# EAGLE design BP_MCU (EAGLE 9.7.0)
Assembly variants: Filtr
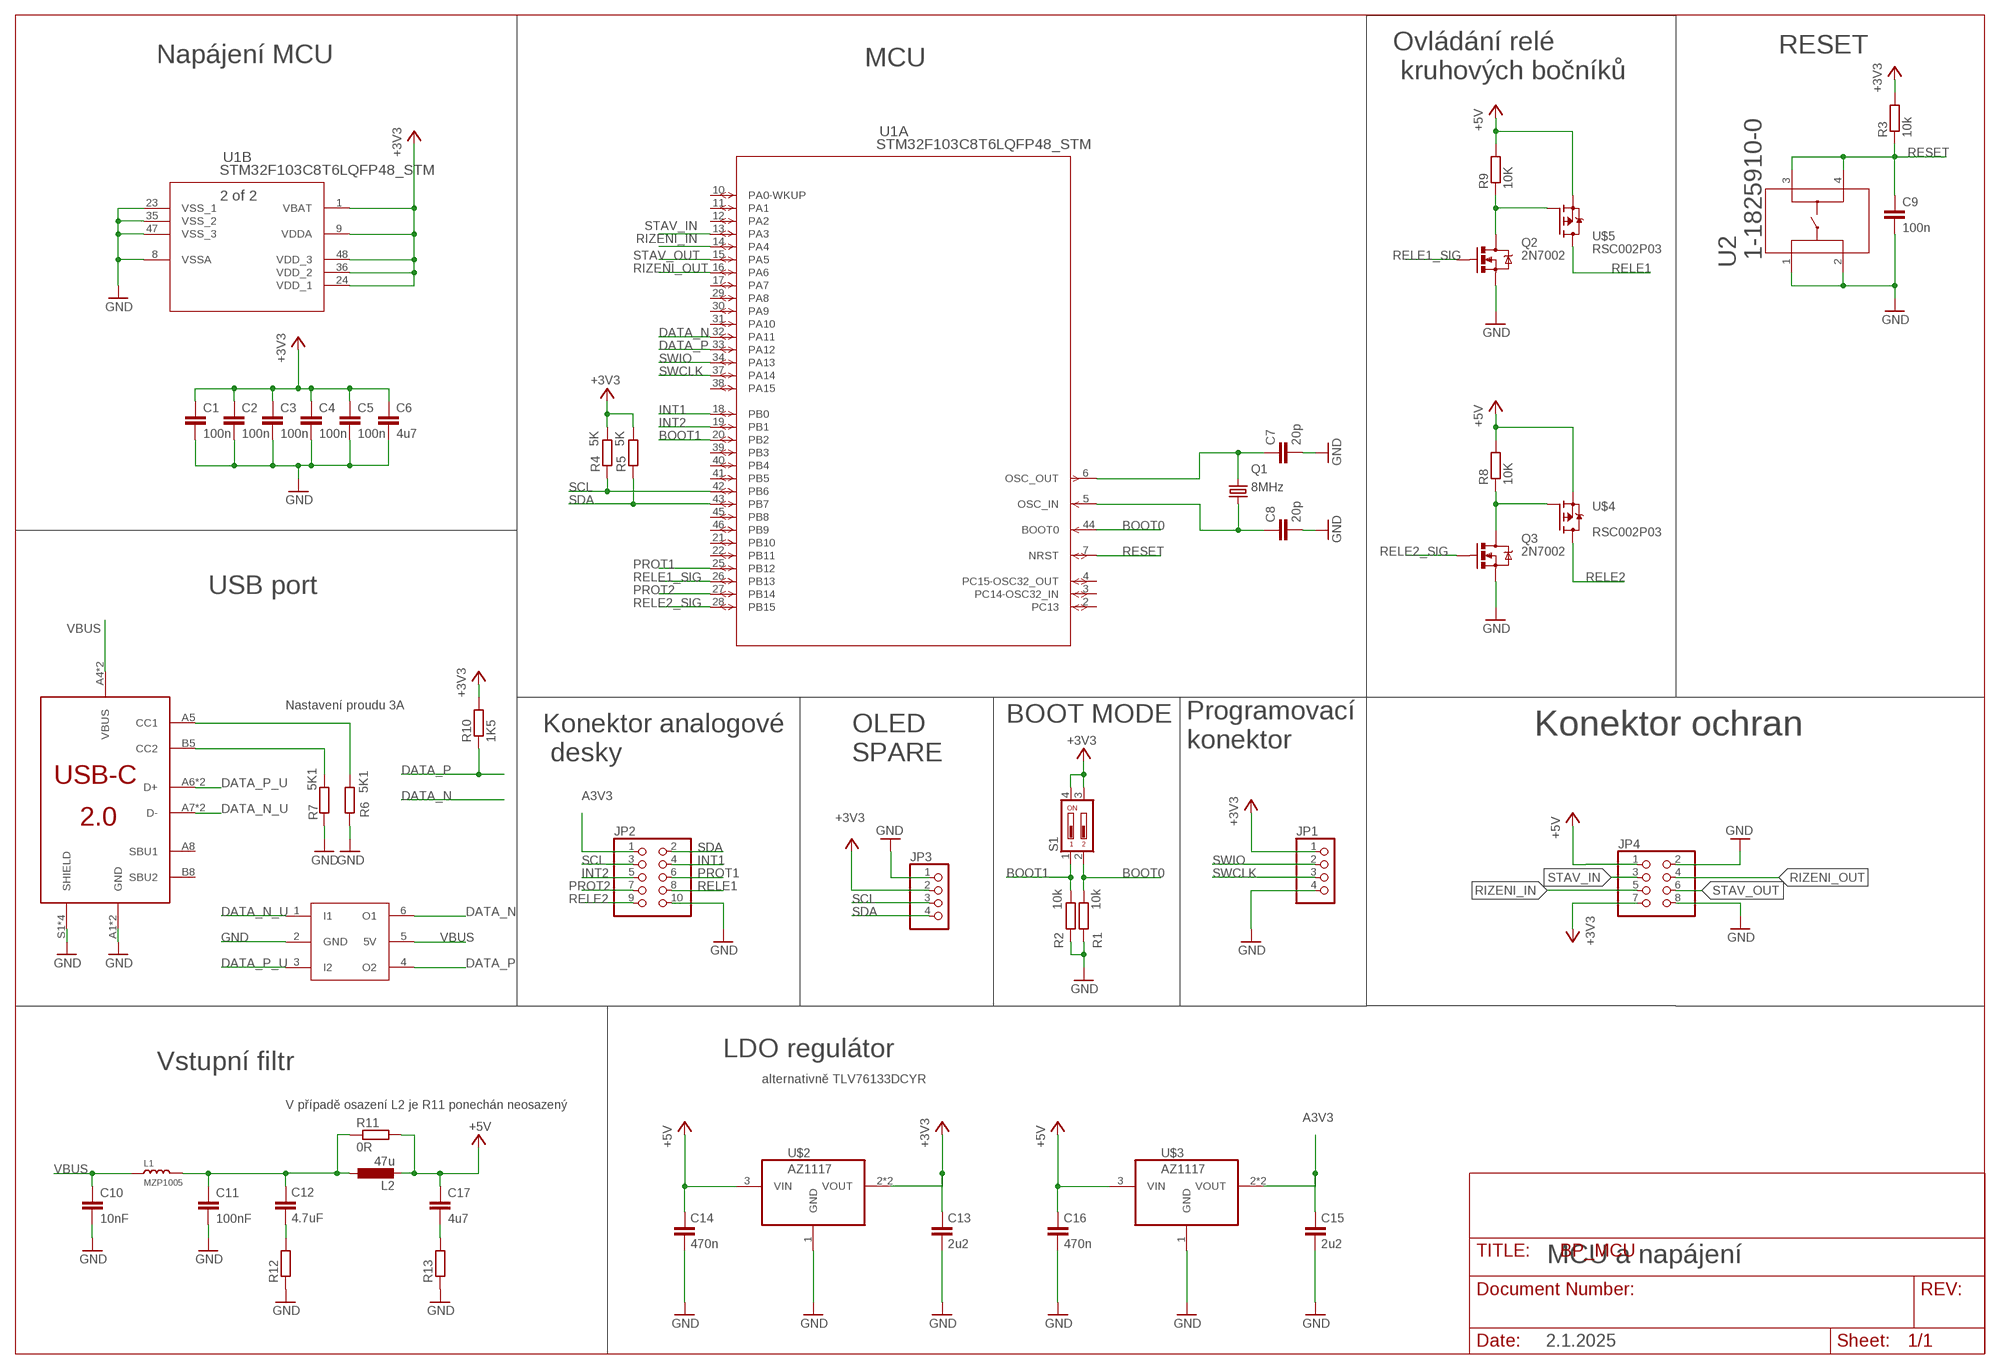
[diagram p0: schematic, sheet 1]

## Parts
C1  100n  C-EUC0805  [C0805]
C2  100n  C-EUC0805  [C0805]
C3  100n  C-EUC0805  [C0805]
C4  100n  C-EUC0805  [C0805]
C5  100n  C-EUC0805  [C0805]
C6  4u7  C-EUC0805  [C0805]
C7  20p  C-EUC0805  [C0805]
C8  20p  C-EUC0805  [C0805]
C9  100n  C-EUC0805  [C0805]
C10  10nF  C-EUC0805  [C0805]
C11  100nF  C-EUC0805  [C0805]
C12  4.7uF  C-EUC0805  [C0805]
C13  2u2  C-EUC0805  [C0805]
C14  470n  C-EUC0805  [C0805]
C15  2u2  C-EUC0805  [C0805]
C16  470n  C-EUC0805  [C0805]
C17  4u7  C-EUC0805  [C0805]
JP1  PINHD-1X4  [1X04]
JP2  PINHD-2X5  [2X05]
JP3  PINHD-1X4  [1X04]
JP4  PINHD-2X4  [2X04]
L1  MZP1005  INDUCTOR_INDUCTOR/FERRITE-BEAD0402  [INDUCTOR_L0402]
L2  47u  AMRM00101040470MA1  [AMRM001]
Q1  8MHz  CRYSTALHC49UP  [HC49UP]
Q2  2N7002  MOSFET-NCHANNEL2N7002PW  [SOT323]
Q3  2N7002  MOSFET-NCHANNEL2N7002PW  [SOT323]
R1  10k  R-EU_R0805  [R0805]
R2  10k  R-EU_R0805  [R0805]
R3  10k  R-EU_R0805  [R0805]
R4  5K  R-EU_R0805  [R0805]  (not fitted in variant Filtr)
R5  5K  R-EU_R0805  [R0805]  (not fitted in variant Filtr)
R6  5K1  R-EU_R0805  [R0805]
R7  5K1  R-EU_R0805  [R0805]
R8  10K  R-EU_R0805  [R0805]
R9  10K  R-EU_R0805  [R0805]
R10  1K5  R-EU_R0805  [R0805]
R11  0R  R-EU_R0805  [R0805]  (not fitted in variant Filtr)
R12  R-EU_R0805  [R0805]
R13  R-EU_R0805  [R0805]
S1  SD4-02  [SD4-02]
U1  STM32F103C8T6LQFP48_STM  [LQFP48_STM]
U2  1-1825910-0  [SWITCH_1-1825910-0]
U$1  217179-0001-USB-C  [TYPEC16]
U$2  AZ1117  [SOT230P700X180-4N]
U$3  AZ1117  [SOT230P700X180-4N]
U$4  RSC002P03  [SOT95]
U$5  RSC002P03  [SOT95]
U$6  USBLC6-2  [SOT23-6L]

## Nets
+3V3: C1.1 C2.1 C3.1 C4.1 C5.1 C6.1 C13.1 JP1.1 JP3.2 JP4.7 R3.2 R4.2 R5.2 R10.2 S1.3 S1.4 U1.1(B:VBAT) U1.9(B:VDDA) U1.24(B:VDD_1) U1.36(B:VDD_2) U1.48(B:VDD_3) U$2.2(VOUT) U$2.4(VOUT)
+5V: C14.1 C16.1 C17.1 JP4.1 L2.P$2 R8.2 R9.2 R11.2 U$2.3(VIN) U$3.3(VIN) U$4.1(S) U$5.1(S)
A3V3: C15.1 JP2.1 U$3.2(VOUT) U$3.4(VOUT)
BOOT0: R1.2 S1.2 U1.44(A:BOOT0)
BOOT1: R2.2 S1.1 U1.20(A:PB2)
DATA_N: U1.32(A:PA11) U$6.6(O1)
DATA_N_U: U$1.A7(D-) U$1.B7(D-) U$6.1(I1)
DATA_P: R10.1 U1.33(A:PA12) U$6.4(O2)
DATA_P_U: U$1.A6(D+) U$1.B6(D+) U$6.3(I2)
GND: C1.2 C2.2 C3.2 C4.2 C5.2 C6.2 C7.2 C8.2 C9.2 C10.2 C11.2 C13.2 C14.2 C15.2 C16.2 JP1.4 JP2.10 JP3.1 JP4.2 JP4.8 Q2.2(S) Q3.2(S) R1.1 R2.1 R6.2 R7.2 R12.1 R13.1 U1.8(B:VSSA) U1.23(B:VSS_1) U1.35(B:VSS_2) U1.47(B:VSS_3) U2.1 U2.2 U$1.A1(GND) U$1.A12(GND) U$1.S1(SHIELD) U$1.S2(SHIELD) U$1.S3(SHIELD) U$1.S4(SHIELD) U$2.1(GND) U$3.1(GND) U$6.2(GND)
INT1: JP2.4 U1.18(A:PB0)
INT2: JP2.5 U1.19(A:PB1)
N$1: Q2.3(D) R9.1 U$5.2(G)
N$2: Q3.3(D) R8.1 U$4.2(G)
N$3: R7.1 U$1.B5(CC2)
N$4: R6.1 U$1.A5(CC1)
N$5: C12.2 R12.2
N$6: C11.1 C12.1 L1.2 L2.P$1 R11.1
N$7: C17.2 R13.2
OSC_N: C8.1 Q1.1 U1.5(A:OSC_IN)
OSC_P: C7.1 Q1.2 U1.6(A:OSC_OUT)
PROT1: JP2.6 U1.25(A:PB12)
PROT2: JP2.7 U1.27(A:PB14)
RELE1: JP2.8 U$5.3(D)
RELE1_SIG: Q2.1(G) U1.26(A:PB13)
RELE2: JP2.9 U$4.3(D)
RELE2_SIG: Q3.1(G) U1.28(A:PB15)
RESET: C9.1 R3.1 U1.7(A:NRST) U2.3 U2.4
RIZENI_IN: JP4.5 U1.14(A:PA4)
RIZENI_OUT: JP4.4 U1.16(A:PA6)
SCL: JP2.3 JP3.3 R4.1 U1.42(A:PB6)
SDA: JP2.2 JP3.4 R5.1 U1.43(A:PB7)
STAV_IN: JP4.3 U1.13(A:PA3)
STAV_OUT: JP4.6 U1.15(A:PA5)
SWCLK: JP1.3 U1.37(A:PA14)
SWIO: JP1.2 U1.34(A:PA13)
VBUS: C10.1 L1.1 U$1.A4(VBUS) U$1.A9(VBUS) U$6.5(5V)
Unconnected: U1.2(A:PC13) U1.3(A:PC14-OSC32_IN) U1.4(A:PC15-OSC32_OUT) U1.10(A:PA0-WKUP) U1.11(A:PA1) U1.12(A:PA2) U1.17(A:PA7) U1.21(A:PB10) U1.22(A:PB11) U1.29(A:PA8) U1.30(A:PA9) U1.31(A:PA10) U1.38(A:PA15) U1.39(A:PB3) U1.40(A:PB4) U1.41(A:PB5) U1.45(A:PB8) U1.46(A:PB9) U$1.A8(SBU1) U$1.B8(SBU2)

## Notes on the sheet
- RESET
- MCU
- Ovládání relé
   kruhových bočníků
- Napájení MCU
- USB port
- Nastavení proudu 3A | BOOT MODE
- Konektor ochran
- Programovací 
  konektor
- Konektor analogové
   desky
- OLED 
  SPARE
- LDO regulátor
- Vstupní filtr
- alternativně TLV76133DCYR
- V případě osazení L2 je R11 ponechán neosazený
- MCU a napájení
- 2.1.2025

## Library data of the parts
C1-C10 C13-C17 = rcl:C-EU: CAPACITOR, European symbol; SPICEPREFIX: C
C11 C12 = resistor:C-EU: CAPACITOR, European symbol
JP1 JP3 = pinhead:PINHD-1X4: PIN HEADER
JP2 = pinhead:PINHD-2X5: PIN HEADER
JP4 = pinhead:PINHD-2X4: PIN HEADER
L1 = BeagleBone_Blue_R3:INDUCTOR_INDUCTOR/FERRITE-BEAD
L2 = Induktory:AMRM00101040470MA1
Q1 = crystal:CRYSTAL: CRYSTAL; OC_FARNELL: unknown; OC_NEWARK: unknown
Q2 Q3 = BeagleBone_Blue_R3:MOSFET-NCHANNEL: Common NMOSFET Parts MFG P/N Store ID Prod ID FDD8780 TRANS-09984 SI7820DN TRANS-11055 FDS6630A IC-08089 2N7002PW TRANS-11151 FQP30N06L COM-10213 TRANS-10060 BSS123LT1G TRANS-08345 BSS138 TRANS-00830 BS170 2N7000; PROD_ID: TRANS-11151
R1-R13 = rcl:R-EU_: RESISTOR, European symbol; SPICEPREFIX: R
S1 = switch-dil:SD4-02: DIL/CODE SWITCH; OC_FARNELL: unknown; OC_NEWARK: unknown
U1 = 2024-10-04_13-16-44_Library:STM32F103C8T6; COPYRIGHT: Copyright (C) 2024 Ultra Librarian. All rights reserved.; MANUFACTURER_PART_NUMBER: STM32F103C8T6; MFR_NAME: STMicroelectronics
U2 = Switches:1-1825910-0; BUILT_BY: EMA_UL_Team; CATEGORY: Tactile Switches; COPYRIGHT: Copyright (C) 2016 Accelerated Designs. All rights reserved; DESCRIPTION: FSM6JH=6MM TACT SWITCH, HIGH TEMP; MANUFACTURER_PART_NUMBER: 1-1825910-0; PART_STATUS: active; SERIES: Unknown; VENDOR: TE Connectivity
U$1 = USB_conn:217179-0001-USB-C
U$2 U$3 = Regulatory:AZ1117
U$4 U$5 = Mosfety:RSC002P03
U$6 = ESD:USBLC6-2

## Board
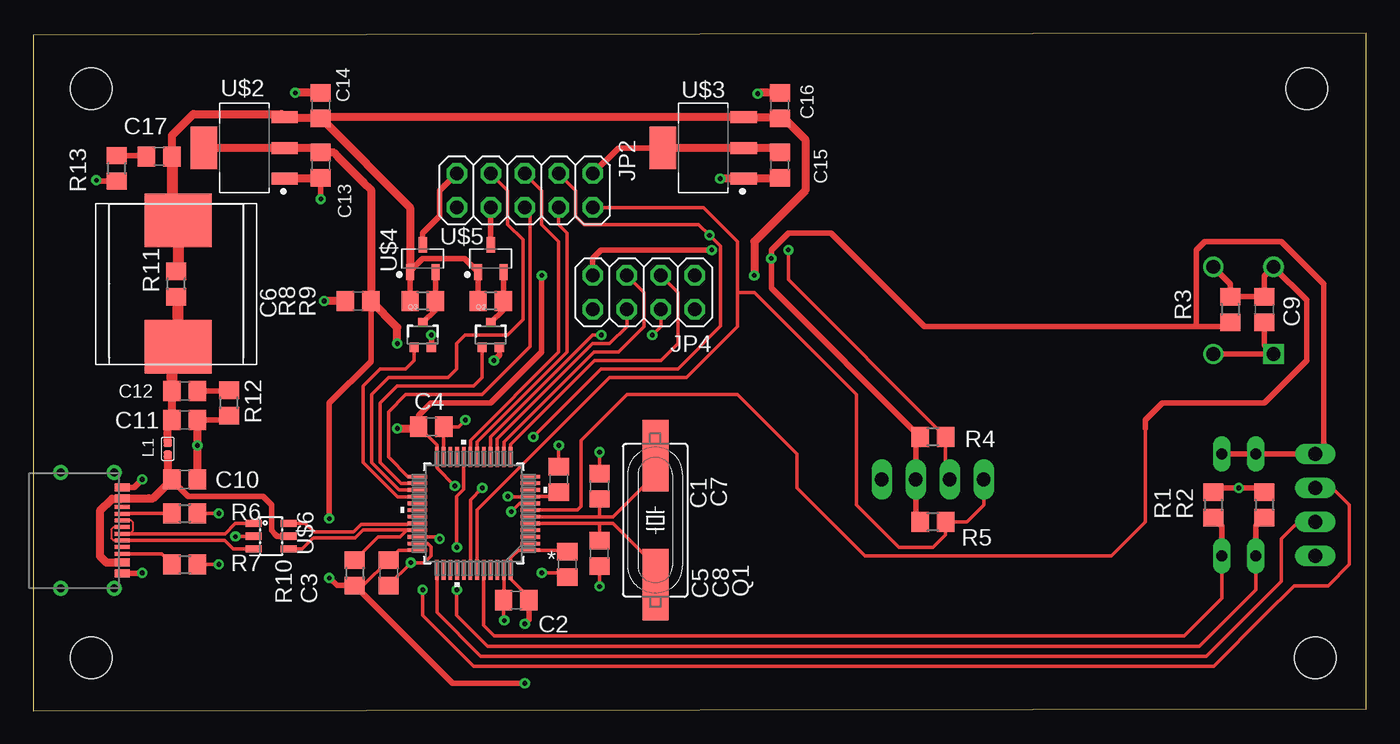
[diagram p1: board, top side]
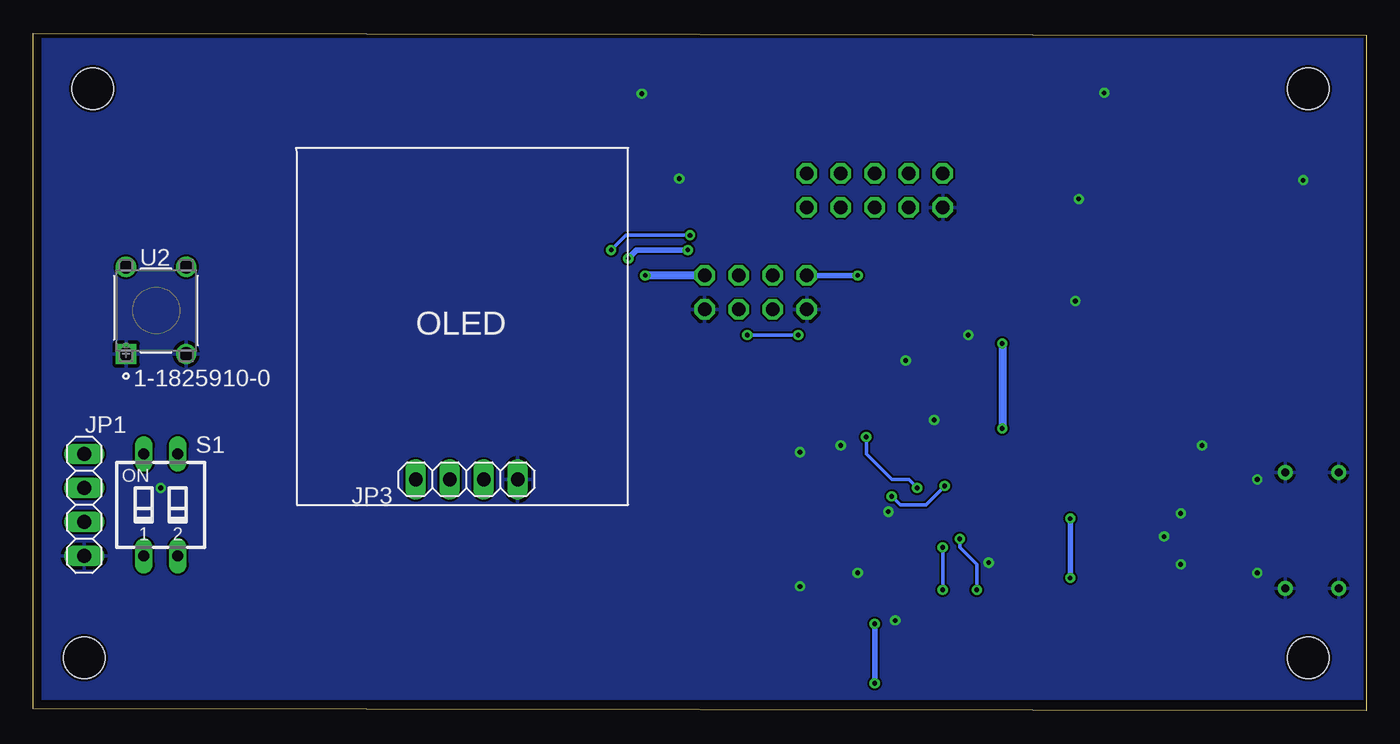
[diagram p2: board, bottom side, seen from below]

Size 99.55 x 50.6 mm. Coordinates in mm from the lower left corner, seen from the top.
Outline: 0,0 99.55,0.13 99.55,50.6 0,50.47 0,0
Copper layers (1*16): Top 0.035mm / dielectric 1.5mm / Bottom 0.035mm
Design rules "Fusion Electronics Design Rules": minimum track width 6mil, minimum drill 0.35mm, track to track 6mil, track to pad 6mil, pad to pad 6mil, via to via 6mil, smd to smd 6mil, copper to edge 0.2mm, drill to drill 0.45mm, minimum pad ring 10mil, minimum via ring 8mil, stop-mask expansion 4mil, vias tented up to drill 0mil, thermal gap 10mil
Holes 3.1 mm at 4.32,46.48 4.32,3.94 95.12,46.48 95.76,3.94

### Footprints (pad centres in the part's own frame; a part is rotated, then mirrored left to right if it is on the bottom)
C0805 = smd 1.3 x 1.5: 1 -0.95,0; 2 0.95,0
1X04 = drill 1.016 long: 1 -3.81,0; 2 -1.27,0; 3 1.27,0; 4 3.81,0
2X05 = drill 1.016 octagon: 1 -5.08,-1.27; 2 -5.08,1.27; 3 -2.54,-1.27; 4 -2.54,1.27; 5 0,-1.27; 6 0,1.27; 7 2.54,-1.27; 8 2.54,1.27; 9 5.08,-1.27; 10 5.08,1.27
2X04 = drill 1.016 octagon: 1 -3.81,-1.27; 2 -3.81,1.27; 3 -1.27,-1.27; 4 -1.27,1.27; 5 1.27,-1.27; 6 1.27,1.27; 7 3.81,-1.27; 8 3.81,1.27
INDUCTOR_L0402 = smd 0.635 x 0.635: 1 -0.445,0; 2 0.445,0
AMRM001 = smd 5 x 4: P$1 -0.127,4.695; P$2 -0.127,-4.746
HC49UP = smd 5.334 x 1.93: 1 -4.826,0; 2 4.826,0
SOT323 = smd 0.7 x 0.7: 1 -0.65,-0.925; 2 0.65,-0.925; 3 0,0.925
R0805 = smd 1.3 x 1.5: 1 -0.95,0; 2 0.95,0
SD4-02 = drill 0.813 long: 1 -1.27,-3.81; 2 1.27,-3.81; 3 1.27,3.81; 4 -1.27,3.81
LQFP48_STM = smd 1.473 x 0.279: 1 -4.216,2.75; 2 -4.216,2.25; 3 -4.216,1.75; 4 -4.216,1.25; 5 -4.216,0.75; 6 -4.216,0.25; 7 -4.216,-0.25; 8 -4.216,-0.75; 9 -4.216,-1.25; 10 -4.216,-1.75; 11 -4.216,-2.25; 12 -4.216,-2.75; 25 4.216,-2.75; 26 4.216,-2.25; 27 4.216,-1.75; 28 4.216,-1.25; 29 4.216,-0.75; 30 4.216,-0.25; 31 4.216,0.25; 32 4.216,0.75; 33 4.216,1.25; 34 4.216,1.75; 35 4.216,2.25; 36 4.216,2.75 | smd 0.279 x 1.473: 13 -2.75,-4.216; 14 -2.25,-4.216; 15 -1.75,-4.216; 16 -1.25,-4.216; 17 -0.75,-4.216; 18 -0.25,-4.216; 19 0.25,-4.216; 20 0.75,-4.216; 21 1.25,-4.216; 22 1.75,-4.216; 23 2.25,-4.216; 24 2.75,-4.216; 37 2.75,4.216; 38 2.25,4.216; 39 1.75,4.216; 40 1.25,4.216; 41 0.75,4.216; 42 0.25,4.216; 43 -0.25,4.216; 44 -0.75,4.216; 45 -1.25,4.216; 46 -1.75,4.216; 47 -2.25,4.216; 48 -2.75,4.216
SWITCH_1-1825910-0 = drill 1.016 pad 1.524 square: 1 -6.502,4.496 | drill 1.016 pad 1.524: 2 -6.502,0; 3 0,0; 4 0,4.496
TYPEC16 = smd 0.6 x 1.15: A1 -3.2,1.25; A4 -2.4,1.25; A9 2.4,1.25; A12 3.2,1.25 | smd 0.3 x 1.15: A5 -1.25,1.25; A6 -0.25,1.25; A7 0.25,1.25; A8 1.25,1.25; B5 1.75,1.25; B6 0.75,1.25; B7 -0.75,1.25; B8 -1.75,1.25 | drill 0.6 pad 1 slot 1.4 rotated 90: S1 -4.32,0.66; S2 4.32,0.66 | drill 0.6 pad 1 slot 1.8 rotated 90: S3 -4.32,-3.34; S4 4.32,-3.34
SOT230P700X180-4N = smd 1.966 x 0.891: 1 -3.023,2.3; 2 -3.023,0; 3 -3.023,-2.3 | smd 1.966 x 3.192: 4 3.023,0
SOT95 = smd 1.182 x 0.612: 1 -1.025,0.95; 2 -1.025,-0.95; 3 1.025,0
SOT23-6L = smd 0.55 x 1.2: 1 -0.95,-1.3; 2 0,-1.3; 3 0.95,-1.3; 4 0.95,1.3; 5 0,1.3; 6 -0.95,1.3

### Placement (x,y rotation side)
C1  39.24,17.27 90 top
C2  36.07,8.25 180 top
C3  26.54,10.29 270 top
C4  29.72,21.21 0 top
C5  39.88,10.92 270 top
C6  24.26,30.61 180 top
C7  42.29,16.76 90 top
C8  42.28,11.75 270 top
C9  91.95,29.97 270 top
C10  11.3,17.27 0 top
C11  11.3,21.72 0 top
C12  11.3,23.88 0 top
C13  21.46,40.77 270 top
C14  21.46,45.21 90 top
C15  55.75,40.77 270 top
C16  55.75,45.21 90 top
C17  9.4,41.4 180 top
JP1  95.76,15.37 270 bottom
JP2  36.7,38.86 180 top
JP3  67.18,17.27 180 bottom
JP4  45.59,31.24 180 top
L1  10.03,19.56 90 top
L2  10.67,31.88 180 top
Q1  46.46,14.22 90 top
Q2  34.16,28.07 0 top
Q3  29.08,28.07 0 top
R1  88.14,15.37 270 top
R2  91.95,15.37 270 top
R3  89.41,29.97 270 top
R4  67.18,20.45 180 top
R5  67.18,14.1 180 top
R6  11.3,14.73 0 top
R7  11.3,10.92 0 top
R8  29.08,30.61 180 top
R9  34.16,30.61 180 top
R10  24,10.29 270 top
R11  10.67,31.88 90 top
R12  14.6,22.99 90 top
R13  6.22,40.51 90 top
S1  90.04,15.37 0 bottom
U1  32.89,14.73 180 top
U2  88.14,33.15 90 bottom
U$1  5.38,13.46 270 top
U$2  15.75,42.04 180 top
U$3  50.04,42.04 180 top
U$4  29.08,33.78 90 top
U$5  34.16,33.78 90 top
U$6  17.75,13.03 270 top

### Tracks (layer width: path | path; a pad name or v marks a point on that pad's centre or on a via)
+3V3  (via drill 0.35)
  Top 0.254: C1.1 38.92,16 37.97,16 37.13,16 U1.9 35.45,15.98 v35.43,16 | C2.1 37.02,8.45 35.94,9.52 35.64,9.82 U1.48 35.64,11.39 35.69,11.43 36.24,11.98 U1.1 39.77,11.98 C5.1 | U1.36 27.29,11.98 C3.1 24.64,9.34 R10.2 | 28.87,21.21 C4.1 30.14,19.83 U1.24 30.14,18.12 v31.48,16.78
  Top 0.406: S1.3 S1.4 JP1.1 96.39,19.81 96.39,30.61 96.39,31.88 93.22,35.05 91.31,35.05 87.5,35.05 86.87,34.42 86.87,28.7 | C4.1 28.77,22.04 29.72,22.99 34.16,22.99 37.97,26.8 v37.97,32.51 | v22.1,14.35 22.1,22.99 25.21,26.1 C6.1 | v22.1,9.91 22.67,9.34 R10.2 31.31,2.03 v36.7,2.03 | R5.2 65.91,14.42 65.91,16.64 JP3.2 65.91,19.81 66.23,20.13 R4.2 55.12,31.56 v55.12,33.78 55.12,34.42 56.39,35.69 59.56,35.69 66.55,28.7 86.87,28.7 | v50.67,34.42 42.42,34.42 41.78,33.78 JP4.7 | 86.87,28.7 89.09,28.7 R3.2 | C2.1 37.02,6.79 v36.7,6.48
  Top 0.61: U$2.4 17.02,42.04 U$2.2 21.14,42.04 C13.1 22.42,41.72 22.73,41.4 24.64,39.5 25.21,38.93 C6.1 27.18,28.64 v27.18,27.43 | v27.18,21.08 28.75,21.08 28.87,21.21
  Bottom 0.254: v35.43,16 34.8,15.37 32.89,15.37 v31.48,16.78
  Bottom 0.406: v37.97,32.51 JP4.7 | v22.1,14.35 v22.1,9.91 | v55.12,33.78 54.48,34.42 v50.67,34.42 | v36.7,6.48 v36.7,2.03
  Bottom 0.61: v27.18,27.43 v27.18,21.08
+5V  (via drill 0.35)
  Top 0.406: R8.2 U$4.1 28.13,32.83 29.08,33.78 30.35,33.78 32.19,33.78 U$5.1 R9.2
  Top 0.61: 18.85,44.26 C14.1 21.62,44.1 | 18.85,44.26 U$2.3 | 18.85,44.26 18.53,44.58 11.94,44.58 10.35,42.99 C17.1 | 21.62,44.1 28.13,37.59 28.13,32.83 | 21.62,44.1 21.86,44.34 U$3.3 55.68,44.34 C16.1 56.07,44.26 57.66,42.67 57.66,38.86 53.85,35.05 v53.85,32.51
  Top 0.813: C17.1 10.35,36.76 9.78,36.2 10.37,36.2 L2.P$2 10.79,32.95 R11.2
  Bottom 0.61: JP4.1 v53.85,32.51
A3V3
  Top 0.406: JP2.1 43.69,42.04 U$3.4
  Top 0.61: C15.1 55.43,42.04 U$3.2 U$3.4
BOOT0
  Top 0.254: S1.2 88.77,8.38 87.5,7.11 85.98,5.59 34.42,5.59 33.64,6.36 U1.44
  Top 0.406: R1.2 88.77,13.78 S1.2
BOOT1  (via drill 0.35)
  Top 0.254: v31.62,9.02 31.62,7.11 33.93,4.8 87.1,4.8 91.31,9.02 S1.1 | v31.62,12.19 31.62,16 32.14,16.52 32.14,16.64 U1.20
  Top 0.406: R2.2 91.31,13.78 S1.1
  Bottom 0.254: v31.62,9.02 v31.62,12.19
DATA_N
  Top 0.254: U1.32 27.98,13.98 27.92,13.92 24.46,13.92 23.94,13.4 23.88,13.34 20.96,13.34 20.31,13.98 U$6.6
DATA_N_U
  Top 0.152: U$1.B7 7.28,14.21 7.44,14.06 7.44,13.47 7.18,13.21 U$1.A7
  Top 0.254: U$1.A7 14.31,13.21 15.08,13.98 U$6.1
DATA_P
  Top 0.152: 27.81,13.51 27.84,13.48 U1.33
  Top 0.254: R10.1 25.75,12.98 27.32,12.98 27.39,12.98 27.92,13.51 27.81,13.51 | 27.81,13.51 24.63,13.51 24.04,12.92 20.92,12.92 20.83,12.83 20.08,12.08 U$6.4 | 27.84,13.48 27.81,13.51
DATA_P_U
  Top 0.152: U$1.B6 5.98,12.71 5.83,12.86 5.83,13.56 5.98,13.71 U$1.A6
  Top 0.254: U$1.B6 14.3,12.71 14.93,12.08 U$6.3
GND  (via drill 0.35)
  Top 0.254: C7.2 v42.29,19.3 | C8.2 42.28,9.28 v42.29,9.27 | U1.8 36.31,15.48 v35.69,14.86 | v39.24,19.81 C1.2 | U1.47 35.14,8.28 C2.2 35.12,6.79 v35.18,6.73 | U1.35 29.45,12.48 29.72,12.21 29.72,12.19 29.72,11.56 29.21,11.05 v28.19,11.05 26.54,9.4 C3.2 | U1.23 30.64,21.18 C4.2 31.75,21.21 v32.26,21.72 | C5.2 39.56,10.29 v37.97,10.29 | v13.84,14.73 R6.2 | R7.2 v13.84,10.92 | U$6.2 15.11,13.03 v15.09,13
  Top 0.406: Q3.2 29.73,28.05 v29.72,28.07 | Q2.2 34.81,26.58 v34.39,26.16 | R2.1 91.63,16.64 v90.04,16.64 88.46,16.64 R1.1 | U$1.A1 7.52,16.66 v8.13,17.27 | U$1.A12 8.1,10.26 v8.13,10.29 | C9.2 91.95,27.33 U2.1 U2.2 | v21.46,38.23 C13.2 | R13.1 4.76,39.56 v4.7,39.62 | C11.2 14.29,21.72 R12.1
  Top 0.61: C15.2 55.67,39.74 U$3.1 51.32,39.74 v51.31,39.75 | C13.2 21.38,39.74 U$2.1 | C10.2 v12.25,19.81 C11.2 | C16.2 54.16,46.16 v54.1,46.1 | C14.2 v19.56,46.16 | C6.2 v21.72,30.61
  pour Bottom: 0.08,0.84 98.86,0.84 98.86,50.22 0.08,50.22
INT1
  Top 0.254: U1.18 33.14,20.06 34.16,21.08 39.88,26.8 39.88,31.24 39.88,35.69 39.24,36.32 JP2.4
INT2
  Top 0.254: U1.19 32.64,20.2 39.24,26.8 39.24,31.24 39.24,35.05 37.97,36.32 37.97,37.59 37.97,38.86 JP2.5
N$1
  Top 0.406: U$5.2 R9.1 35.11,29.94 Q2.3
N$2
  Top 0.406: U$4.2 R8.1 30.03,29.94 Q3.3
N$3
  Top 0.254: U$1.B5 9.56,11.71 R7.1
N$4
  Top 0.254: U$1.A5 6.65,14.73 R6.1
N$5
  Top 0.406: R12.2 14.54,23.88 C12.2
N$6
  Top 0.61: C12.1 C11.1 10.03,21.4 L1.2
  Top 0.813: C12.1 10.35,26.74 L2.P$1 10.79,30.8 R11.1
N$7
  Top 0.406: R13.2 8.39,41.46 C17.2
OSC_N
  Top 0.254: Q1.1 46.46,10.82 44.2,13.08 43.29,13.98 41.78,13.98 | C8.1 42.28,13.97 42.26,13.98 41.78,13.98 | 41.78,13.98 U1.5
OSC_P
  Top 0.254: 42.29,14.48 U1.6 | 42.29,14.48 43.31,14.48 43.56,14.73 46.46,17.63 Q1.2 | 42.29,14.48 C7.1
PROT1
  Top 0.254: U1.25 28.66,17.46 28,17.46 26.52,18.94 26.52,22.33 27.81,23.62 33.53,23.62 37.11,27.2 37.11,37.19 JP2.6
PROT2
  Top 0.254: U1.27 27.33,16.48 25.27,18.54 25.27,23.62 26.54,24.89 30.99,24.89 31.62,25.53 31.62,27.43 32.26,28.07 32.89,28.07 34.8,28.07 35.43,28.07 36.07,28.7 36.58,29.21 36.58,35.18 35.43,36.32 35.43,38.86 JP2.7
RELE1
  Top 0.406: U$5.3 JP2.8
RELE1_SIG
  Top 0.254: Q2.1 33.53,27.13 33.53,24.89 32.89,24.26 32.26,24.26 27.18,24.26 25.91,22.99 25.91,22.35 25.91,19.18 25.91,18.54 27.47,16.98 U1.26
RELE2
  Top 0.406: U$4.3 29.08,35.69 30.35,36.96 30.35,38.86 JP2.9
RELE2_SIG
  Top 0.254: Q3.1 28.43,26.18 28.45,26.16 27.81,25.53 25.91,25.53 24.64,24.26 24.64,18.54 27.18,16 27.2,15.98 U1.28
RESET
  Top 0.254: U1.7 40.64,14.98 40.89,15.24 40.89,19.81 40.89,20.19 44.32,23.62 52.58,23.62 57.02,19.18 57.02,16.64 62.1,11.56 80.52,11.56 83.06,14.1 83.06,21.08
  Top 0.406: U2.3 89.41,31.88 R3.1 C9.1 91.95,32.46 U2.4 95.12,30.66 95.12,30.61 95.12,26.16 93.85,24.89 91.95,22.99 84.33,22.99 83.06,21.72 83.06,21.08
RIZENI_IN
  Top 0.254: U1.14 35.14,20.07 40.93,25.87 41.86,26.8 43.69,26.8 45.59,28.7 45.59,31.24 JP4.5
RIZENI_OUT  (via drill 0.35)
  Top 0.254: v46.23,28.07 46.86,28.7 JP4.4 | U1.16 34.14,20.43 40.51,26.8 41.78,28.07 v42.42,28.07
  Bottom 0.254: v46.23,28.07 v42.42,28.07
SCL  (via drill 0.35)
  Top 0.254: U1.42 32.64,15.75 v33.53,16.64 | v37.34,20.45 38.61,21.72 42.42,25.53 47.5,25.53 48.13,25.53 51.33,28.72 51.33,34.69 v50.5,35.52 49.7,36.32 41.15,36.32 40.51,36.96 40.51,38.86 JP2.3 | JP3.3 68.13,17.59 R4.1 56.39,32.19 v56.39,34.42
  Bottom 0.254: v33.53,16.64 34.16,17.27 35.43,17.27 37.34,19.18 v37.34,20.45 | v50.5,35.52 55.29,35.52 v56.39,34.42
SDA
  Top 0.254: U1.43 33.14,14.98 37.34,19.18 43.05,24.89 47.5,24.89 48.77,24.89 50.67,26.8 52.58,28.7 52.58,29.97 52.58,31.24 | 52.58,31.24 52.58,35.05 51.31,36.32 50.04,37.59 JP2.2 | 52.58,31.24 53.85,31.24 61.47,23.62 61.47,15.37 64.64,12.19 67.18,12.19 68.13,13.14 R5.1 69.72,14.1 70.99,15.37 JP3.4
STAV_IN
  Top 0.254: U1.13 35.64,19.87 36.78,21.01 41.93,26.16 46.86,26.16 48.13,27.43 48.13,31.24 JP4.3
STAV_OUT
  Top 0.254: U1.15 34.64,20.29 41.76,27.41 43.03,27.41 44.32,28.7 JP4.6
SWCLK
  Top 0.254: U1.37 30.14,7.32 33.4,4.06 87.63,4.06 93.22,9.65 93.22,10.29 93.22,12.83 94.49,14.1 JP1.3
SWIO  (via drill 0.35)
  Top 0.254: v29.08,9.02 29.08,7.11 32.26,3.94 32.87,3.33 33.78,3.33 88.14,3.33 88.16,3.33 91.95,7.11 94.17,9.33 96.71,9.33 98.3,10.92 98.3,15.37 97.03,16.64 JP1.2 | U1.34 30.2,12.98 v30.35,12.83
  Bottom 0.254: v29.08,9.02 29.08,10.92 29.72,11.56 30.35,12.19 v30.35,12.83
VBUS
  Top 0.254: C10.1 10.03,17.59
  Top 0.406: U$6.5 18.21,13.03 18.03,13.21 17.78,13.46 17.78,15.37 17.14,16 11.56,16 10.35,17.21 C10.1
  Top 0.61: U$1.A9 5.45,11.06 4.95,11.56 4.95,14.9 5.87,15.82 6.59,15.82 U$1.A4 8.62,15.86 8.94,15.86 C10.1 | L1.1 10.03,17.59

### Text on the board
bPlace: OLED